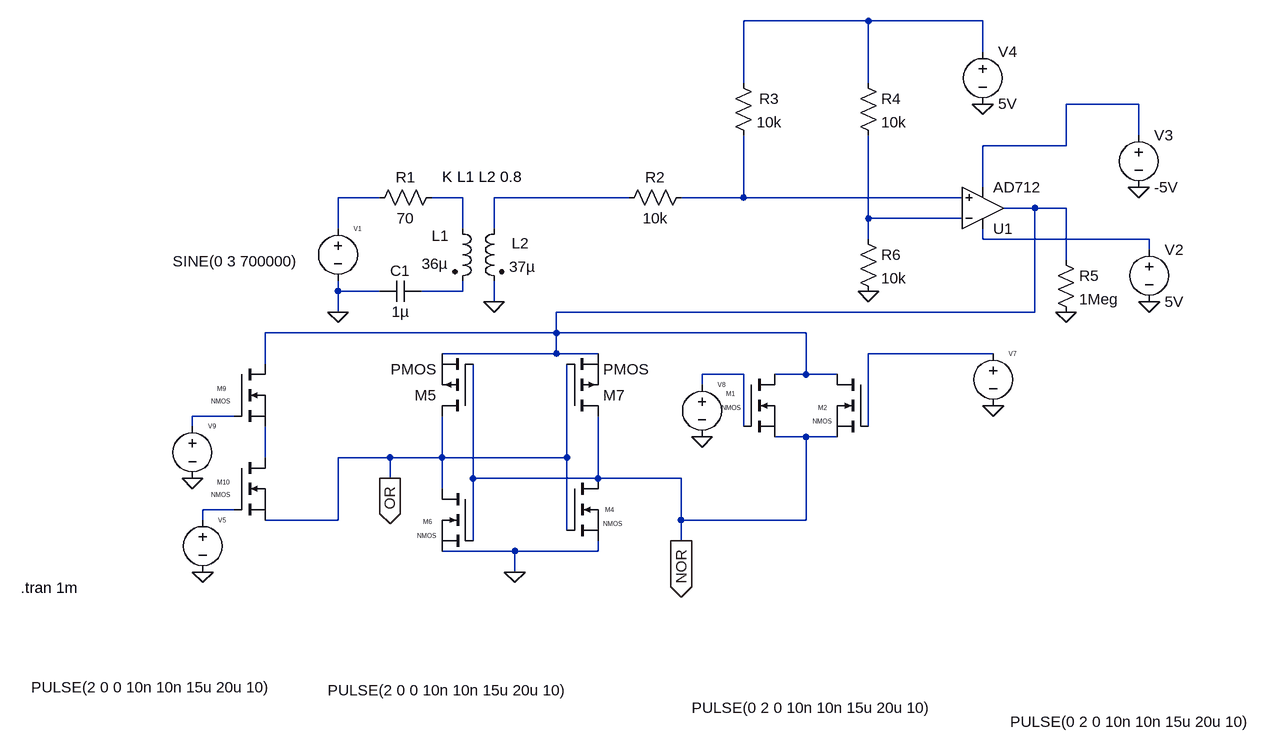
[diagram p0: schematic PFAL_wireless_nor gate.asc]
PFAL_wireless_nor gate.asc, the LTspice schematic file:
Version 4
SHEET 1 1288 1000
WIRE 672 -432 480 -432
WIRE 848 -432 672 -432
WIRE 848 -384 848 -432
WIRE 480 -336 480 -432
WIRE 672 -336 672 -432
WIRE 1088 -304 976 -304
WIRE 1088 -256 1088 -304
WIRE 976 -240 976 -304
WIRE 976 -240 848 -240
WIRE 848 -176 848 -240
WIRE -80 -160 -144 -160
WIRE 48 -160 0 -160
WIRE 304 -160 96 -160
WIRE 480 -160 480 -256
WIRE 480 -160 384 -160
WIRE 816 -160 480 -160
WIRE 928 -144 880 -144
WIRE 976 -144 928 -144
WIRE 672 -128 672 -256
WIRE 816 -128 672 -128
WIRE -144 -112 -144 -160
WIRE 48 -112 48 -160
WIRE 96 -112 96 -160
WIRE 672 -96 672 -128
WIRE 848 -96 848 -112
WIRE 1104 -96 848 -96
WIRE 1104 -80 1104 -96
WIRE 976 -64 976 -144
WIRE -144 -16 -144 -32
WIRE -80 -16 -144 -16
WIRE 48 -16 48 -32
WIRE 48 -16 -16 -16
WIRE 96 0 96 -32
WIRE -144 16 -144 -16
WIRE 928 16 928 -144
WIRE 928 16 192 16
WIRE 192 48 192 16
WIRE 192 48 -256 48
WIRE 576 48 192 48
WIRE 192 80 192 48
WIRE 192 80 16 80
WIRE 256 80 192 80
WIRE 864 80 672 80
WIRE -256 96 -256 48
WIRE 480 112 416 112
WIRE 576 112 576 48
WIRE 576 112 528 112
WIRE 624 112 576 112
WIRE 416 128 416 112
WIRE -304 176 -368 176
WIRE -368 192 -368 176
WIRE 480 192 480 112
WIRE 672 192 672 80
WIRE 576 208 528 208
WIRE 624 208 576 208
WIRE -256 240 -256 192
WIRE -64 240 -144 240
WIRE 16 240 16 176
WIRE 16 240 -64 240
WIRE 208 240 208 96
WIRE 208 240 16 240
WIRE -64 272 -64 240
WIRE 64 272 64 96
WIRE 256 272 256 176
WIRE 256 272 64 272
WIRE 384 272 256 272
WIRE 16 288 16 240
WIRE -304 320 -352 320
WIRE -352 336 -352 320
WIRE -144 336 -144 240
WIRE -144 336 -256 336
WIRE 384 336 384 272
WIRE 576 336 576 208
WIRE 576 336 384 336
WIRE 208 352 208 240
WIRE 64 368 64 272
WIRE 384 368 384 336
WIRE 128 384 16 384
WIRE 256 384 256 368
WIRE 256 384 128 384
WIRE 128 416 128 384
FLAG 128 416 0
FLAG 96 0 0
FLAG -144 16 0
FLAG 672 -16 0
FLAG 976 16 0
FLAG 848 -304 0
FLAG 1088 -176 0
FLAG 1104 0 0
FLAG -368 272 0
FLAG -352 416 0
FLAG 416 208 0
FLAG 864 160 0
FLAG -64 272 OR
IOPIN -64 272 Out
FLAG 384 368 NOR
IOPIN 384 368 Out
SYMBOL nmos 480 112 R0
WINDOW 0 -27 30 Left 0
WINDOW 3 -34 51 Left 0
SYMATTR InstName M1
SYMBOL nmos 208 272 R0
WINDOW 0 59 48 Left 0
WINDOW 3 56 70 Left 0
SYMATTR InstName M4
SYMBOL nmos 64 288 M0
WINDOW 0 63 51 Left 0
WINDOW 3 56 72 Left 0
SYMATTR InstName M6
SYMBOL voltage -144 -128 R0
WINDOW 0 24 16 Left 0
WINDOW 3 -254 66 Left 2
WINDOW 123 0 0 Left 0
WINDOW 39 0 0 Left 0
SYMATTR InstName V1
SYMATTR Value SINE(0 3 700000)
SYMBOL res 16 -176 R90
WINDOW 0 0 56 VBottom 2
WINDOW 3 32 56 VTop 2
SYMATTR InstName R1
SYMATTR Value 70
SYMBOL ind2 32 -128 R0
WINDOW 0 -32 27 Left 2
WINDOW 3 -47 70 Left 2
SYMATTR InstName L1
SYMATTR Value 36µ
SYMBOL ind2 112 -128 M0
WINDOW 0 -38 38 Left 2
WINDOW 3 -48 74 Left 2
SYMATTR InstName L2
SYMATTR Value 37µ
SYMBOL cap -16 -32 R90
WINDOW 0 0 32 VBottom 2
WINDOW 3 32 32 VTop 2
SYMATTR InstName C1
SYMATTR Value 1µ
SYMBOL res 400 -176 R90
WINDOW 0 0 56 VBottom 2
WINDOW 3 32 56 VTop 2
SYMATTR InstName R2
SYMATTR Value 10k
SYMBOL res 464 -352 R0
WINDOW 0 40 40 Left 2
SYMATTR InstName R3
SYMATTR Value 10k
SYMBOL res 656 -352 R0
SYMATTR InstName R4
SYMATTR Value 10k
SYMBOL res 960 -80 R0
SYMATTR InstName R5
SYMATTR Value 1Meg
SYMATTR SpiceLine tol=1 pwr=0.1
SYMBOL res 656 -112 R0
SYMATTR InstName R6
SYMATTR Value 10k
SYMBOL OpAmps\\AD712 848 -80 M180
SYMATTR InstName U1
SYMBOL voltage 1104 -96 R0
WINDOW 123 0 0 Left 0
WINDOW 39 0 0 Left 0
SYMATTR InstName V2
SYMATTR Value 5V
SYMBOL voltage 1088 -272 R0
WINDOW 123 0 0 Left 0
WINDOW 39 0 0 Left 0
SYMATTR InstName V3
SYMATTR Value -5V
SYMBOL voltage 848 -400 R0
WINDOW 123 0 0 Left 0
WINDOW 39 0 0 Left 0
SYMATTR InstName V4
SYMATTR Value 5V
SYMBOL nmos 672 112 M0
WINDOW 0 63 51 Left 0
WINDOW 3 56 72 Left 0
SYMATTR InstName M2
SYMBOL voltage 864 64 R0
WINDOW 0 24 16 Left 0
WINDOW 3 26 582 Left 2
WINDOW 123 0 0 Left 0
WINDOW 39 0 0 Left 0
SYMATTR InstName V7
SYMATTR Value PULSE(0 2 0 10n 10n 15u 20u 10)
SYMBOL voltage 416 112 R0
WINDOW 0 24 16 Left 0
WINDOW 3 -16 513 Left 2
WINDOW 123 0 0 Left 0
WINDOW 39 0 0 Left 0
SYMATTR InstName V8
SYMATTR Value PULSE(0 2 0 10n 10n 15u 20u 10)
SYMBOL voltage -368 176 R0
WINDOW 0 24 16 Left 0
WINDOW 3 -248 417 Left 2
WINDOW 123 0 0 Left 0
WINDOW 39 0 0 Left 0
SYMATTR InstName V9
SYMATTR Value PULSE(2 0 0 10n 10n 15u 20u 10)
SYMBOL voltage -352 320 R0
WINDOW 0 24 16 Left 0
WINDOW 3 192 278 Left 2
WINDOW 123 0 0 Left 0
WINDOW 39 0 0 Left 0
SYMATTR InstName V5
SYMATTR Value PULSE(2 0 0 10n 10n 15u 20u 10)
SYMBOL pmos 64 176 R180
SYMATTR InstName M5
SYMBOL pmos 208 176 M180
SYMATTR InstName M7
SYMBOL nmos -304 96 R0
WINDOW 0 -26 38 Left 0
WINDOW 3 -35 57 Left 0
SYMATTR InstName M9
SYMBOL nmos -304 240 R0
WINDOW 0 -26 38 Left 0
WINDOW 3 -35 57 Left 0
SYMATTR InstName M10
TEXT 16 -192 Left 2 !K L1 L2 0.8
TEXT -632 440 Left 2 !.tran 1m

The netlist it stands for:
* PFAL_wireless_nor gate.asc
M1 N007 N012 NOR NOR NMOS
M4 NOR OR 0 0 NMOS
M6 OR NOR 0 0 NMOS
V1 N003 0 SINE(0 3 700000)
R1 N004 N003 70
L1 N004 N010 36µ
L2 N005 0 37µ
C1 N010 0 1µ
R2 N006 N005 10k
R3 N001 N006 10k
R4 N001 N008 10k
R5 N007 0 1Meg tol=1 pwr=0.1
R6 N008 0 10k
XU1 N006 N008 N009 N002 N007 AD712  ; pins In+ In- V+ V- OUT
V2 N009 0 5V
V3 N002 0 -5V
V4 N001 0 5V
M2 N007 N011 NOR NOR NMOS
V7 N011 0 PULSE(0 2 0 10n 10n 15u 20u 10)
V8 N012 0 PULSE(0 2 0 10n 10n 15u 20u 10)
V9 N013 0 PULSE(2 0 0 10n 10n 15u 20u 10)
V5 N015 0 PULSE(2 0 0 10n 10n 15u 20u 10)
M5 OR NOR N007 N007 PMOS
M7 NOR OR N007 N007 PMOS
M9 N007 N013 N014 N014 NMOS
M10 N014 N015 OR OR NMOS
.model NMOS NMOS
.model PMOS PMOS
.lib standard.mos
K L1 L2 0.8
.tran 1m
.backanno
.end